# EAGLE schematic untitled (EAGLE 7.0.0)
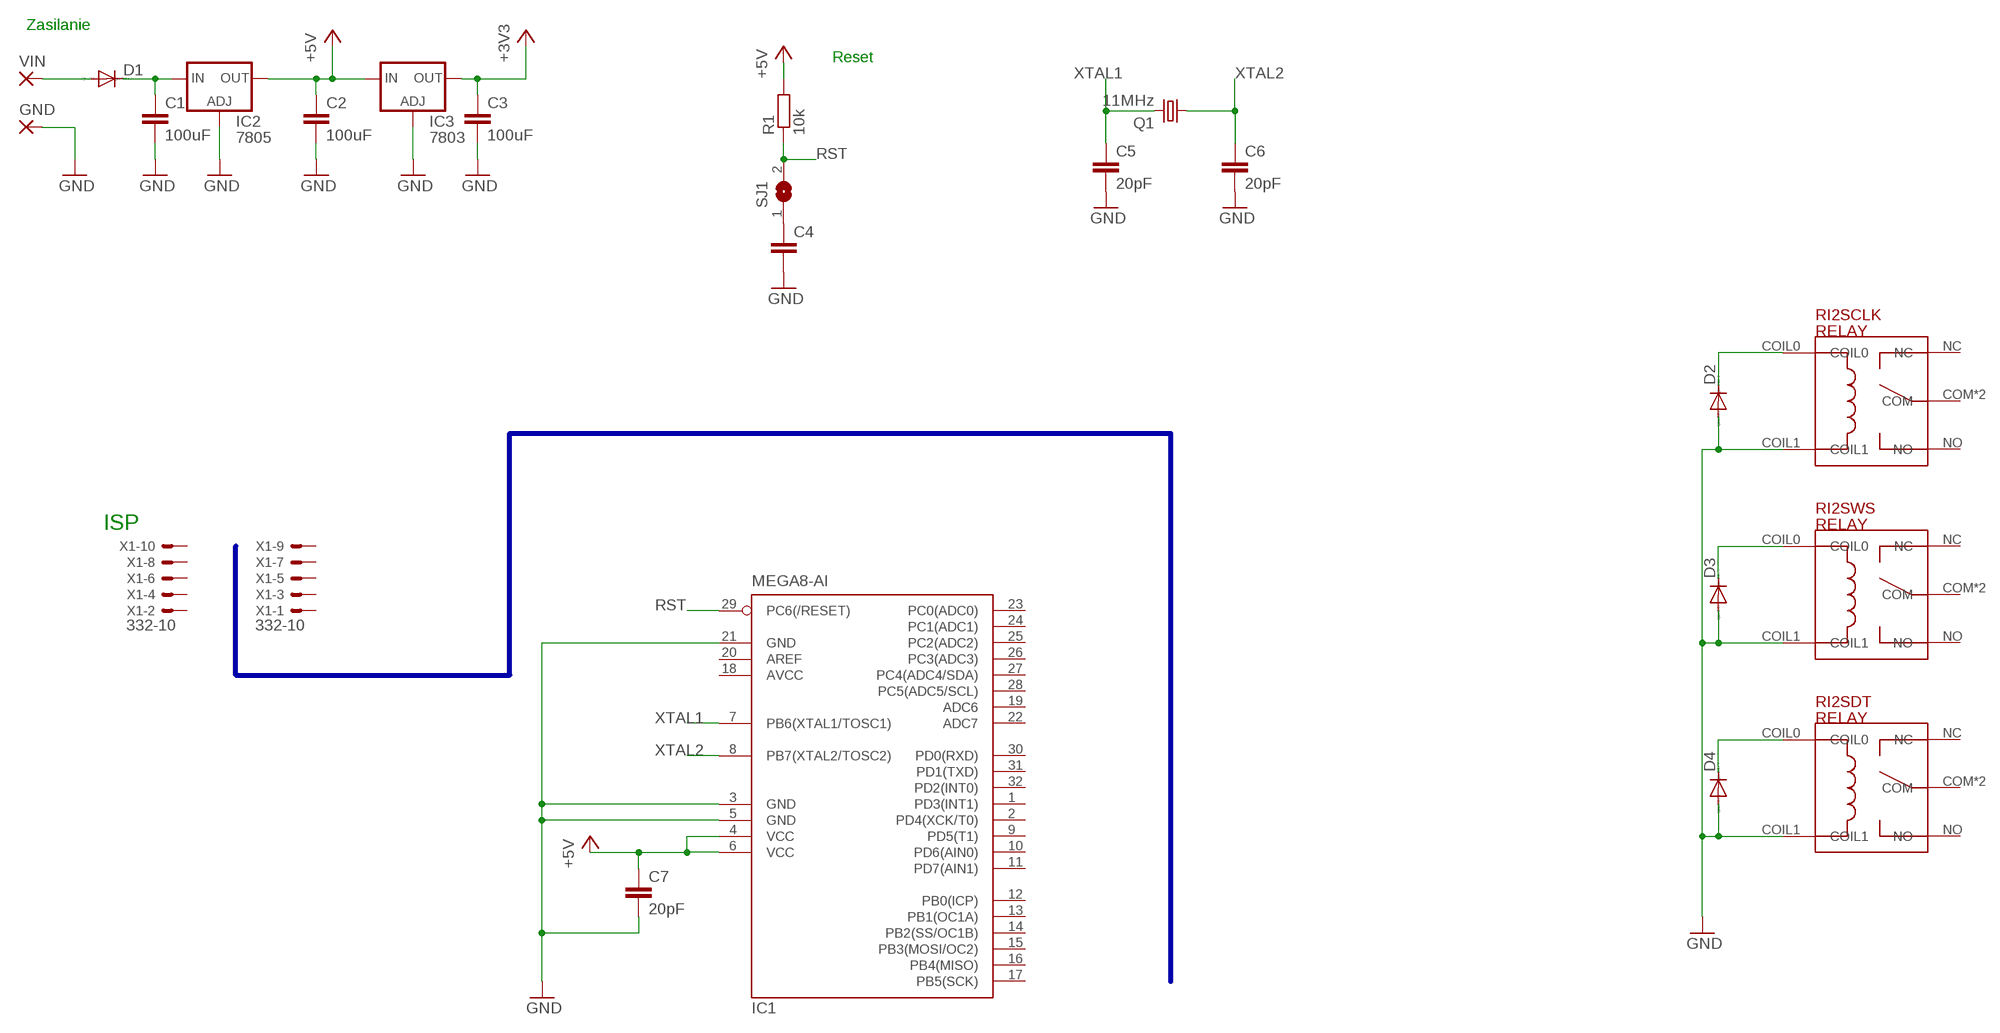
[diagram p0: schematic, sheet 1]

## Parts
C1  100uF  C-EUC0805K  [C0805K]
C2  100uF  C-EUC0805K  [C0805K]
C3  100uF  C-EUC0805K  [C0805K]
C4  C-EUC0603K  [C0603K]
C5  20pF  C-EUC0603K  [C0603K]
C6  20pF  C-EUC0603K  [C0603K]
C7  20pF  C-EUC0603K  [C0603K]
D1  DIODE-DO-214AC  [DO-214AC]
D2  DIODE-SOD110-W  [SOD110-W]
D3  DIODE-SOD110-W  [SOD110-W]
D4  DIODE-SOD110-W  [SOD110-W]
GND  3,17/1,1  [3,17/1,1]
IC1  MEGA8-AI  [TQFP32-08]
IC2  7805  LM317MBSTT3  [SOT223]
IC3  7803  LM317MBSTT3  [SOT223]
Q1  11MHz  CRYSTALHC49U-V  [HC49U-V]
R1  10k  R-EU_R0603  [R0603]
RI2SCLK  RELAY  5V_RELAY_SWITCH  [DIP14]
RI2SDT  RELAY  5V_RELAY_SWITCH  [DIP14]
RI2SWS  RELAY  5V_RELAY_SWITCH  [DIP14]
SJ1  SJ  [SJ]
VIN  3,17/1,1  [3,17/1,1]
X1  332-10  [332-10]

## Nets
+3V3: C3.1 IC3.4(OUT)
+5V: C2.1 C7.1 IC1.4(VCC) IC1.6(VCC) IC2.4(OUT) IC3.3(IN) R1.2
GND: C1.2 C2.2 C3.2 C4.2 C5.2 C6.2 C7.2 D2.A D3.A D4.A GND.1(P) IC1.3(GND) IC1.5(GND) IC1.21(GND) IC2.1(ADJ) IC3.1(ADJ) RI2SCLK.COIL1 RI2SDT.COIL1 RI2SWS.COIL1
N$1: D1.A VIN.1(P)
N$2: C1.1 D1.C IC2.3(IN)
N$3: D2.C RI2SCLK.COIL0
N$4: C4.1 SJ1.1
N$5: D3.C RI2SWS.COIL0
N$6: D4.C RI2SDT.COIL0
RST: IC1.29(PC6(/RESET)) R1.1 SJ1.2
XTAL1: C5.1 IC1.7(PB6(XTAL1/TOSC1)) Q1.2
XTAL2: C6.1 IC1.8(PB7(XTAL2/TOSC2)) Q1.1
Unconnected: IC1.1(PD3(INT1)) IC1.2(PD4(XCK/T0)) IC1.9(PD5(T1)) IC1.10(PD6(AIN0)) IC1.11(PD7(AIN1)) IC1.12(PB0(ICP)) IC1.13(PB1(OC1A)) IC1.14(PB2(SS/OC1B)) IC1.15(PB3(MOSI/OC2)) IC1.16(PB4(MISO)) IC1.17(PB5(SCK)) IC1.19(ADC6) IC1.20(AREF) IC1.22(ADC7) IC1.23(PC0(ADC0)) IC1.24(PC1(ADC1)) IC1.25(PC2(ADC2)) IC1.26(PC3(ADC3)) IC1.27(PC4(ADC4/SDA)) IC1.28(PC5(ADC5/SCL)) IC1.30(PD0(RXD)) IC1.31(PD1(TXD)) IC1.32(PD2(INT0)) RI2SCLK.COM RI2SCLK.COM1(COM) RI2SCLK.NC RI2SCLK.NO RI2SDT.COM RI2SDT.COM1(COM) RI2SDT.NC RI2SDT.NO RI2SWS.COM RI2SWS.COM1(COM) RI2SWS.NC RI2SWS.NO X1.1 X1.2 X1.3 X1.4 X1.5 X1.6 X1.7 X1.8 X1.9 X1.10

## Buses
ISP[1..10]

## Notes on the sheet
- Zasilanie
- Reset
- ISP

## Power pins joined to a net without a drawn wire
AVCC: IC1.18(AVCC)

## Library data of the parts
C1-C7 = rcl:C-EU: CAPACITOR, European symbol
D1-D4 = diode:DIODE-: DIODE
GND VIN = wirepad:3,17/1,1: THROUGH-HOLE PAD
IC1 = atmel:MEGA8: MICROCONTROLLER 8 Kbytes FLASH, 1 kbytes SRAM, 512 bytes EEPROM, USART, 6-channel 10 bit ADC, 2-channel 8 bit ADC Pin compatible with Atmega48, ATMega88, ATMega168 Source: avr.lbr; MPN: ATMEGA8-16AU; OC_FARNELL: 9171371; OC_NEWARK: 73M8863
IC2 IC3 = v-reg:LM317?*: 500 mA Adjustable Output Positive Voltage Regulator Source: http://www.onsemi.co.jp .. LM317M-D.PDF
Q1 = crystal:CRYSTAL: CRYSTAL; OC_FARNELL: 1666969; OC_NEWARK: unknown
R1 = rcl:R-EU_: RESISTOR, European symbol
RI2SCLK RI2SDT RI2SWS = meder:5V_RELAY_SWITCH
SJ1 = jumper:SJ: SMD solder JUMPER
X1 = con-garry:332-10: 10 Pin - 2mm Dual Row Source: www.mpe-connector.de / garry_shortform_2012.pdf